# Altium schematic sheet Connectors.SchDoc
size A3; SheetNumber: 6; SheetTotal: 7
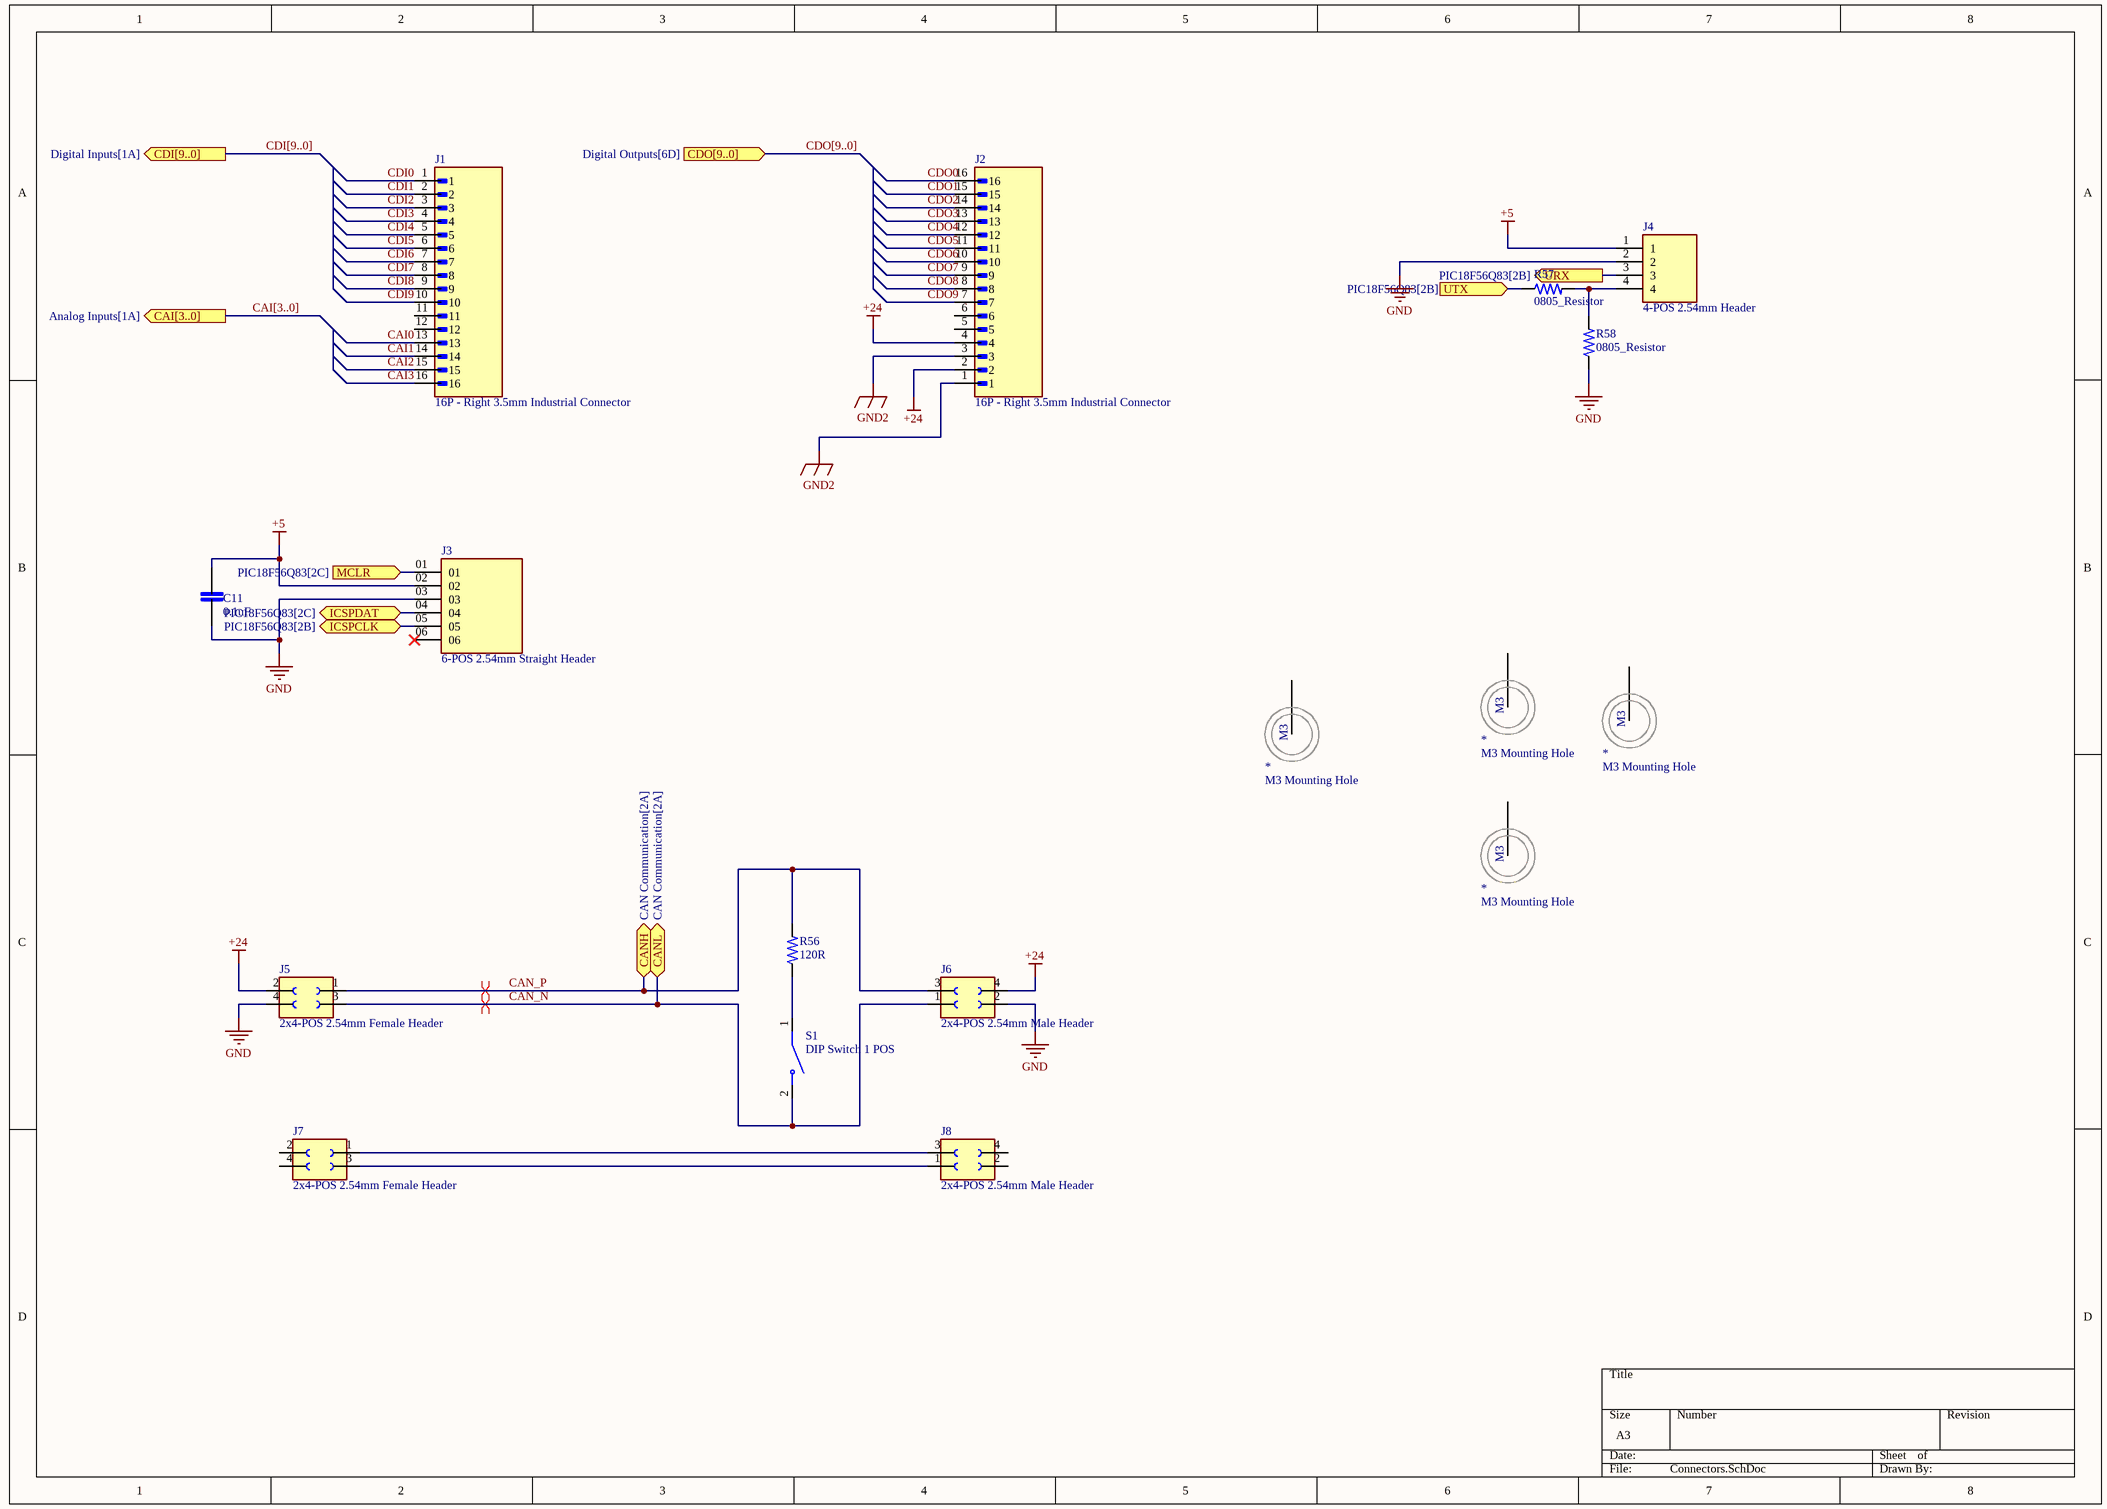
[diagram p0: Connectors.SchDoc]

## Parts
(Parts that share a designator on the sheet are numbered #1, #2 ... from top to bottom, then left to right.)
*#1  M3 Mounting Hole  [M3 - Mounting Hole]
*#2  M3 Mounting Hole  [M3 - Mounting Hole]
*#3  M3 Mounting Hole  [M3 - Mounting Hole]
*#4  M3 Mounting Hole  [M3 - Mounting Hole]
C11  0.1uF  [0805]
J1  16P - Right 3.5mm Industrial Connector  [16P - Right 3.5mm Industrial Connector]
J2  16P - Right 3.5mm Industrial Connector  [16P - Right 3.5mm Industrial Connector]
J3  6-POS 2.54mm Straight Header  [6-POS 2.54mm Header]
J4  4-POS 2.54mm Header  [4-POS 2.54mm Header]
J5  2x4-POS 2.54mm Female Header  [2x4-POS 2.54mm Female Header]
J6  2x4-POS 2.54mm Male Header  [2x4-POS 2.54mm Male Header]
J7  2x4-POS 2.54mm Female Header  [2x4-POS 2.54mm Female Header]
J8  2x4-POS 2.54mm Male Header  [2x4-POS 2.54mm Male Header]
R56  120R  [0805]
R57  0805_Resistor  [0805]
R58  0805_Resistor  [0805]
S1  DIP Switch 1 POS  [DIP Switch 1 POS]

## Ports
CAI[3..0] (out, see Analog Inputs[1A]), CANH (bidir, see CAN Communication[2A]), CANL (bidir, see CAN Communication[2A]), CDI[9..0] (out, see Digital Inputs[1A]), CDO[9..0] (in, see Digital Outputs[6D]), ICSPCLK (bidir, see PIC18F56Q83[2B]), ICSPDAT (bidir, see PIC18F56Q83[2C]), MCLR (in, see PIC18F56Q83[2C]), URX (out, see PIC18F56Q83[2B]), UTX (in, see PIC18F56Q83[2B])

## Nets
+5: C11.1 J3.02 J4.1
+24: J2.2 J2.4 J5.2 J6.4
GND: C11.2 J3.03 J4.2 J5.4 J6.2 R58.1
GND2: J2.1 J2.3
CAI0: J1.13
CAI1: J1.14
CAI2: J1.15
CAI3: J1.16
CAN_N: J5.3 J6.1 S1.2 ; port CANL
CAN_P: J5.1 J6.3 R56.2 ; port CANH
CDI0: J1.1
CDI1: J1.2
CDI2: J1.3
CDI3: J1.4
CDI4: J1.5
CDI5: J1.6
CDI6: J1.7
CDI7: J1.8
CDI8: J1.9
CDI9: J1.10
CDO0: J2.16
CDO1: J2.15
CDO2: J2.14
CDO3: J2.13
CDO4: J2.12
CDO5: J2.11
CDO6: J2.10
CDO7: J2.9
CDO8: J2.8
CDO9: J2.7
ICSPCLK: J3.05 ; port ICSPCLK
ICSPDAT: J3.04 ; port ICSPDAT
MCLR: J3.01 ; port MCLR
URX: J4.3 ; port URX
UTX: R57.1 ; port UTX
NetJ4_4: J4.4 R57.2 R58.2
NetJ7_1: J7.1 J8.3
NetJ7_3: J7.3 J8.1
NetR56_1: R56.1 S1.1

Not connected (* = marked no-connect by the designer): *#1 1(M3); *#2 1(M3); *#3 1(M3); *#4 1(M3); J1 11 12; J2 5 6; J3 06*; J7 2(4) 4(3); J8 2(4) 4(3)

## Buses and harness runs
bus CAI[3..0] = port CAI[3..0]
bus CDI[9..0] = port CDI[9..0]
bus CDO[9..0] = port CDO[9..0]

## Layout directives
differential pair: CAN_N, CAN_P

## Library data of the parts
C11 = 0805_Capacitor: MP: LD051A121KAB2A; MF: AVX; SnapEDA_Link: https://www.snapeda.com/parts/LD051A121KAB2A/AVX/view-part/?ref=snap; Package: 0805 AVX; Check_prices: https://www.snapeda.com/parts/LD051A121KAB2A/AVX/view-part/?ref=eda; Purchase-URL: https://pricing.snapeda.com/search/part/LD051A121KAB2A/?ref=eda; Price: None; Value: *; Availability: In Stock
J1 J2 = 16P - Right 3.5mm Industrial Connector: MF: {'manufacturer': u'Phoenix Contact'}; MP: 1731811; Package: None; Price: None; Value: *; Availability: Unavailable
J3 = 6-POS 2.54mm Straight Header: HEADER, 6 CONTACTS, 1 ROW, THROUGH HOLE, 2.54 MM; Connector Systems:Board-to-Board; Pitch Spacing:2.54mm; No. of Rows:1Rows; No. of Contacts:6Contacts; Contact Termination Type:Through Hole Right Angle; Product Range:HTSW Series RoHS Compliant: Yes; MP: HTSW10608SSLA; MF: Samtec; Purchase-URL: https://pricing.snapeda.com/search/part/HTSW10608SSLA/?ref=eda; Package: None; Check_prices: https://www.snapeda.com/parts/HTSW10608SSLA/Samtec/view-part/?ref=eda; Price: None; SnapEDA_Link: https://www.snapeda.com/parts/HTSW10608SSLA/Samtec/view-part/?ref=snap; Availability: In Stock; Value: *
J4 = 4-POS 2.54mm Header: MP: 5-146290-4; Package: None; Price: None; Value: *; Availability: Unavailable
J5 J7 = 2x4-POS 2.54mm Female Header: MF: WÃ¼rth Elektronik; MP: 613004243121; SnapEDA_Link: https://www.snapeda.com/parts/613004243121/W%C3%BCrth%20Elektronik/view-part/1737074/?ref=snap; Check_prices: https://www.snapeda.com/parts/613004243121/W%C3%BCrth%20Elektronik/view-part/1737074/?ref=eda; Availability: Unavailable; Value: *; Price: None; Package: None
J6 J8 = 2x4-POS 2.54mm Male Header: MF: WÃ¼rth Elektronik; MP: 613004243121; SnapEDA_Link: https://www.snapeda.com/parts/613004243121/W%C3%BCrth%20Elektronik/view-part/1737074/?ref=snap; Check_prices: https://www.snapeda.com/parts/613004243121/W%C3%BCrth%20Elektronik/view-part/1737074/?ref=eda; Availability: Unavailable; Value: *; Price: None; Package: None
R56-R58 = 0805_Resistor: Power_Rating: .25 W; MP: 2-2176053-0; Tolerance: 1%; Resistance: .33; MF: TE Connectivity; Price: None; Availability: In Stock; EU_RoHS_Compliance: Compliant with Exemptions; Package: 0805; Value: *; SnapEDA_Link: https://www.snapeda.com/parts/2-2176053-0/TE+Connectivity/view-part/?ref=snap; Check_prices: https://www.snapeda.com/parts/2-2176053-0/TE+Connectivity/view-part/?ref=eda
S1 = DIP Switch 1 POS: MP: KAE01SGGT; MF: E-Switch; Check_prices: https://www.snapeda.com/parts/KAE01SGGT/E-Switch/view-part/?ref=eda; Value: *; Availability: In Stock; Price: None; Package: None; SnapEDA_Link: https://www.snapeda.com/parts/KAE01SGGT/E-Switch/view-part/?ref=snap; Purchase-URL: https://pricing.snapeda.com/search/part/KAE01SGGT/?ref=eda